# Altium schematic sheet Halley2.SchDoc
size A
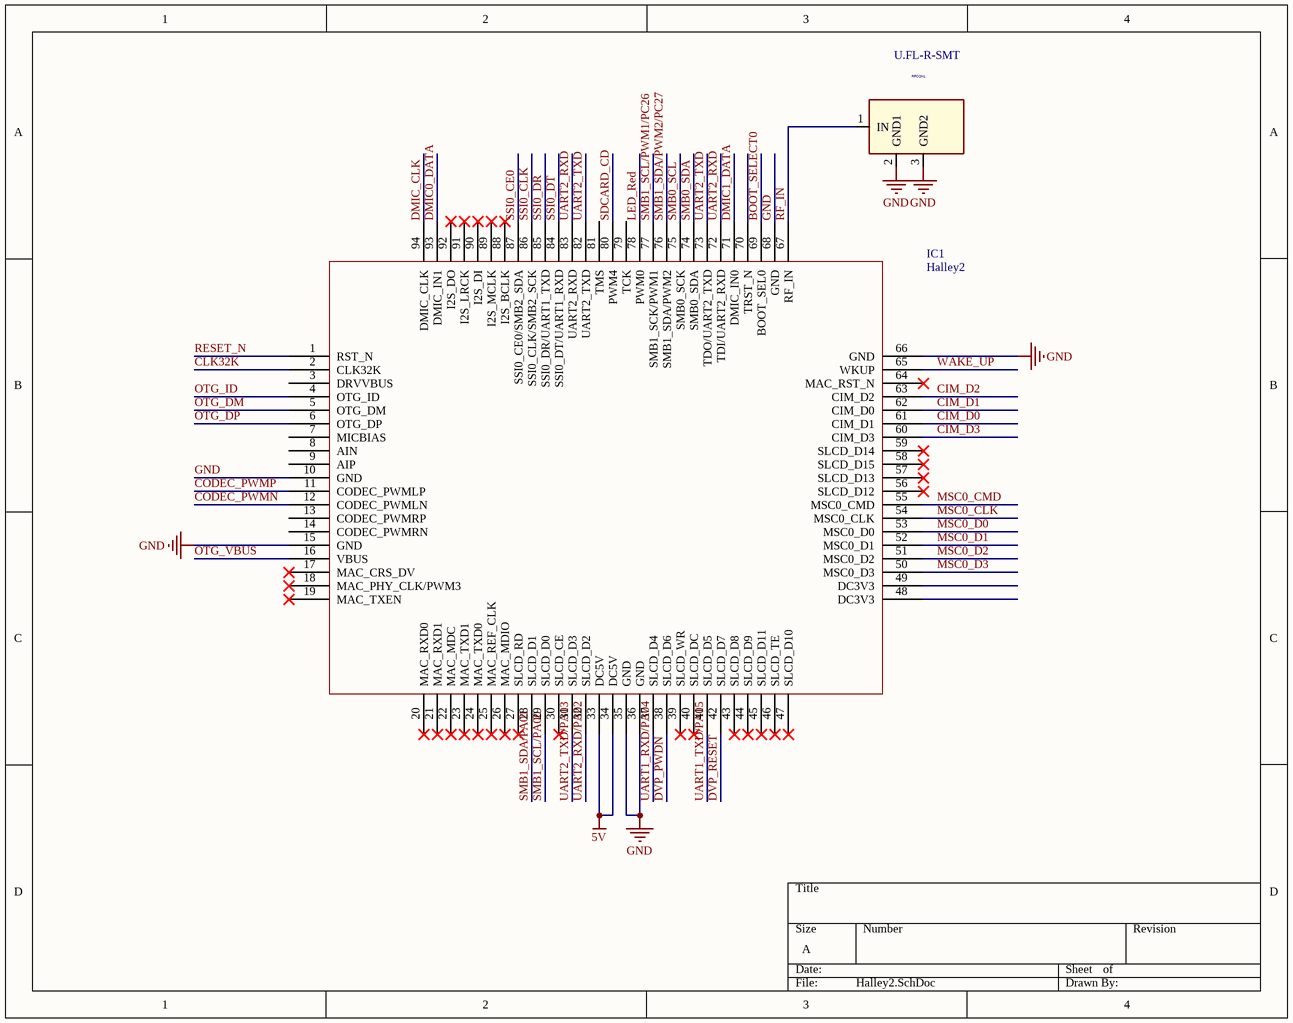
[diagram p0: Halley2.SchDoc]

## Parts
IC1  Halley2  [Halley2]
RFCON1  U.FL-R-SMT  [ANTENNA_DN007N]

## Nets
5V: IC1.33(DC5V) IC1.34(DC5V)
GND: IC1.10(GND) IC1.15(GND) IC1.35(GND) IC1.36(GND) IC1.66(GND) IC1.68(GND) RFCON1.2(GND1) RFCON1.3(GND2)
BOOT_SELECT0: IC1.69(BOOT_SEL0)
CIM_D0: IC1.61(CIM_D1)
CIM_D1: IC1.62(CIM_D0)
CIM_D2: IC1.63(CIM_D2)
CIM_D3: IC1.60(CIM_D3)
CLK32K: IC1.2(CLK32K)
CODEC_PWMN: IC1.12(CODEC_PWMLN)
CODEC_PWMP: IC1.11(CODEC_PWMLP)
DMIC0_DATA: IC1.93(DMIC_IN1)
DMIC1_DATA: IC1.71(DMIC_IN0)
DMIC_CLK: IC1.94(DMIC_CLK)
DVP_PWDN: IC1.38(SLCD_D6)
DVP_RESET: IC1.42(SLCD_D7)
LED_Red: IC1.78(PWM0)
MSC0_CLK: IC1.54(MSC0_CLK)
MSC0_CMD: IC1.55(MSC0_CMD)
MSC0_D0: IC1.53(MSC0_D0)
MSC0_D1: IC1.52(MSC0_D1)
MSC0_D2: IC1.51(MSC0_D2)
MSC0_D3: IC1.50(MSC0_D3)
OTG_DM: IC1.5(OTG_DM)
OTG_DP: IC1.6(OTG_DP)
OTG_ID: IC1.4(OTG_ID)
OTG_VBUS: IC1.16(VBUS)
RESET_N: IC1.1(RST_N)
RF_IN: IC1.67(RF_IN) RFCON1.1(IN)
SDCARD_CD: IC1.80(PWM4)
SMB0_SCL: IC1.75(SMB0_SCK)
SMB0_SDA: IC1.74(SMB0_SDA)
SMB1_SCL/PA00: IC1.29(SLCD_D0)
SMB1_SCL/PWM1/PC26: IC1.77(SMB1_SCK/PWM1)
SMB1_SDA/PA01: IC1.28(SLCD_D1)
SMB1_SDA/PWM2/PC27: IC1.76(SMB1_SDA/PWM2)
SSI0_CE0: IC1.87(SSI0_CE0/SMB2_SDA)
SSI0_CLK: IC1.86(SSI0_CLK/SMB2_SCK)
SSI0_DR: IC1.85(SSI0_DR/UART1_TXD)
SSI0_DT: IC1.84(SSI0_DT/UART1_RXD)
UART1_RXD/PA04: IC1.37(SLCD_D4)
UART1_TXD/PA05: IC1.41(SLCD_D5)
UART2_RXD: IC1.72(TDI/UART2_RXD) IC1.83(UART2_RXD)
UART2_RXD/PA02: IC1.32(SLCD_D2)
UART2_TXD: IC1.73(TDO/UART2_TXD) IC1.82(UART2_TXD)
UART2_TXD/PA03: IC1.31(SLCD_D3)
WAKE_UP: IC1.65(WKUP)

Not connected (* = marked no-connect by the designer): IC1 3(DRVVBUS) 7(MICBIAS) 8(AIN) 9(AIP) 13(CODEC_PWMRP) 14(CODEC_PWMRN) 17(MAC_CRS_DV)* 18(MAC_PHY_CLK/PWM3)* 19(MAC_TXEN)* 20(MAC_RXD0)* 21(MAC_RXD1)* 22(MAC_MDC)* 23(MAC_TXD1)* 24(MAC_TXD0)* 25(MAC_REF_CLK)* 26(MAC_MDIO)* 27(SLCD_RD)* 30(SLCD_CE)* 39(SLCD_WR)* 40(SLCD_DC)* 43(SLCD_D8)* 44(SLCD_D9)* 45(SLCD_D11)* 46(SLCD_TE)* 47(SLCD_D10)* 48(DC3V3) 49(DC3V3) 56(SLCD_D12)* 57(SLCD_D13)* 58(SLCD_D15)* 59(SLCD_D14)* 64(MAC_RST_N)* 70(TRST_N) 79(TCK) 81(TMS) 88(I2S_BCLK)* 89(I2S_MCLK)* 90(I2S_DI)* 91(I2S_LRCK)* 92(I2S_DO)*

## Library data of the parts
RFCON1 = ANT_0: 1ST PART DESCRIPTION: U.FL-R-SMT